# EAGLE design raspdoor (EAGLE 6.5.0)
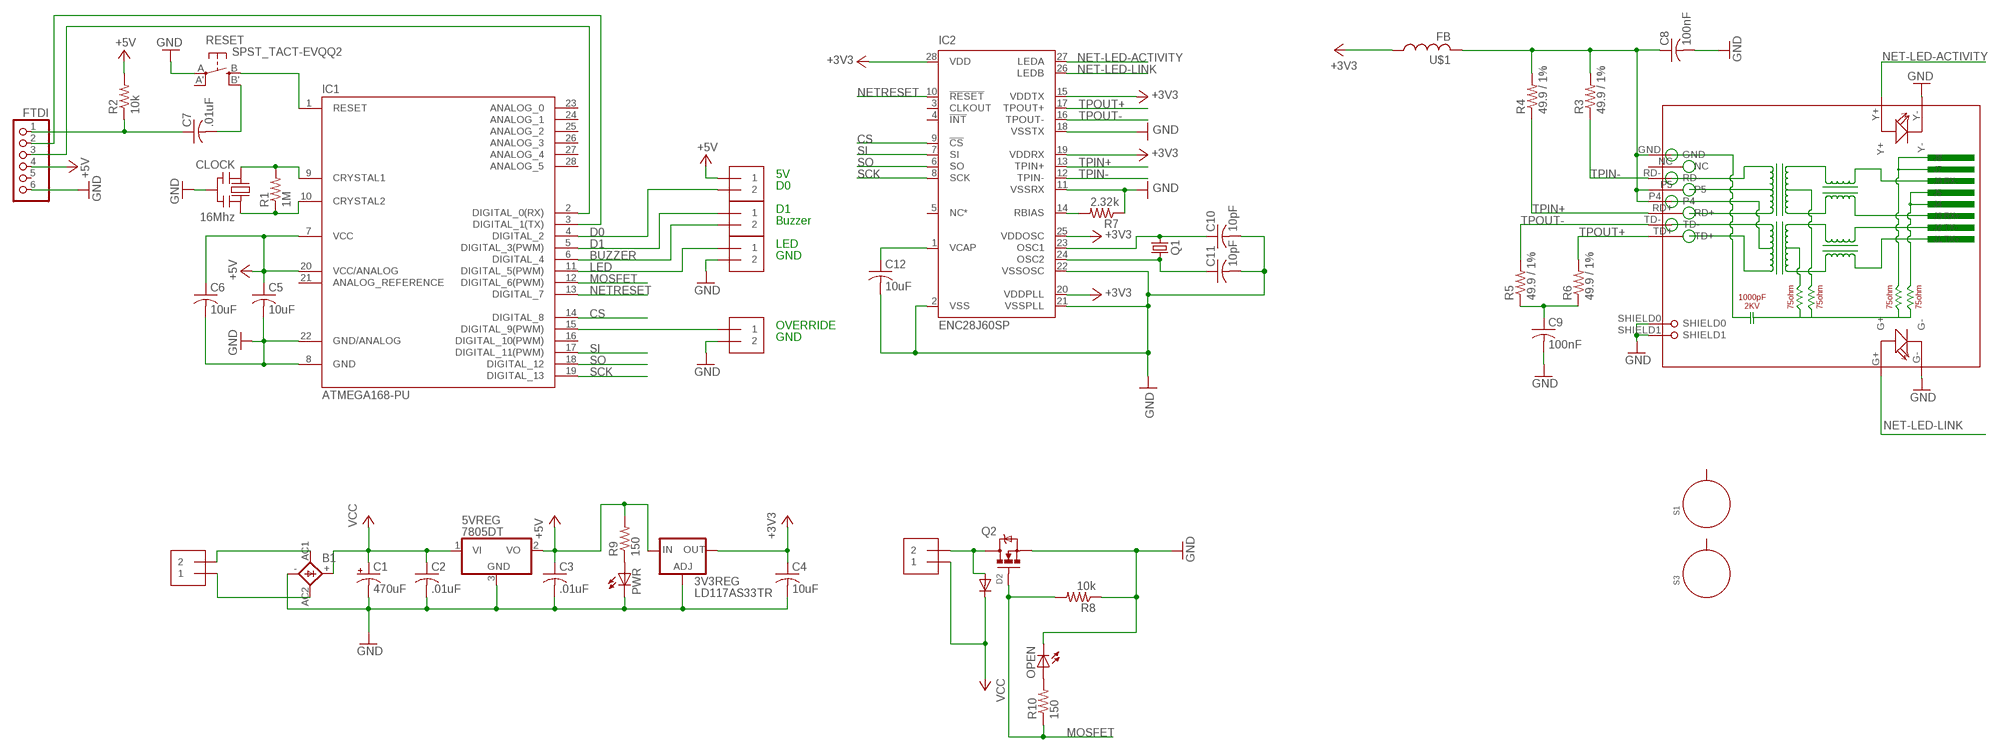
[diagram p0: schematic, sheet 1]

## Parts
3V3REG  LD117AS33TR  [SOT223]
5VREG  7805DT  [TO252]
B1  2KBB  [2KBB]
C1  470uF  CPOL-US153CLV-0810  [153CLV-0810]
C2  .01uF  C-USC0805  [C0805]
C3  .01uF  C-USC0805  [C0805]
C4  10uF  C-USC0805  [C0805]
C5  10uF  C-USC0805  [C0805]
C6  10uF  C-USC0805  [C0805]
C7  .01uF  C-USC0805  [C0805]
C8  100nF  C-USC0805  [C0805]
C9  100nF  C-USC0805  [C0805]
C10  10pF  C-USC0805  [C0805]
C11  10pF  C-USC0805  [C0805]
C12  10uF  C-USC0805  [C0805]
CLOCK  16Mhz  CERMOSCILL-THM  [CERM_OSC]
D2  DIODESMA  [SMADIODE]
FTDI  PINHD-1X6  [1X06]
IC1  ATMEGA168-PU  [DIL28-3]
IC2  ENC28J60SP  [DIL28-3]
J1  1X2-3.5MM  [1X2-3.5MM]
J2  1X2-3.5MM  [1X2-3.5MM]
J3  1X2-3.5MM  [1X2-3.5MM]
J4  1X2-3.5MM  [1X2-3.5MM]
J5  1X2-3.5MM  [1X2-3.5MM]
J6  1X2-3.5MM  [1X2-3.5MM]
OPEN  LEDCHIPLED_0805  [CHIPLED_0805]
PWR  LEDCHIPLED_0805  [CHIPLED_0805]
Q1  CRYSTALHC49S  [HC49/S]
Q2  MOSFET-NCHANNELFQP30N06L  [TO220V]
R1  1M  R-US_R0805  [R0805]
R2  10k  R-US_R0805  [R0805]
R3  49.9 / 1%  R-US_R0805  [R0805]
R4  49.9 / 1%  R-US_R0805  [R0805]
R5  49.9 / 1%  R-US_R0805  [R0805]
R6  49.9 / 1%  R-US_R0805  [R0805]
R7  2.32k  R-US_R0805  [R0805]
R8  10k  R-US_R0805  [R0805]
R9  150  R-US_R0805  [R0805]
R10  150  R-US_R0805  [R0805]
RESET  SPST_TACT-EVQQ2  [EVQ-Q2]
RJ1  HR911105A  [HR911105A]
S1  STANDOFF_ELECTRICAL  [STANDOFF-ELECTRICAL]
S3  STANDOFF_ELECTRICAL  [STANDOFF-ELECTRICAL]
U$1  FB  [FB]

## Nets
+3V3: 3V3REG.4(OUT) C4.1 IC2.15(VDDTX) IC2.19(VDDRX) IC2.20(VDDPLL) IC2.25(VDDOSC) IC2.28(VDD) U$1.P$1
+5V: 3V3REG.3(IN) 5VREG.2(VO) C3.1 C5.1 C6.1 FTDI.4 IC1.7(VCC) IC1.20(VCC/ANALOG) J3.1 R2.2 R9.2
AC1 [AC1]: B1.AC1 J1.2
AC2 [AC1]: B1.AC2 J1.1
BUZZER: IC1.6(DIGITAL_4) J4.2
CS: IC1.14(DIGITAL_8) IC2.9(!CS)
D0: IC1.4(DIGITAL_2) J3.2
D1: IC1.5(DIGITAL_3(PWM)) J4.1
GND: 3V3REG.1(ADJ) 5VREG.3(GND) B1.- C1.- C2.2 C3.2 C4.2 C5.2 C6.2 C8.2 C9.2 C10.2 C11.2 C12.2 CLOCK.P$2(GND) FTDI.6 IC1.8(GND) IC1.22(GND/ANALOG) IC2.2(VSS) IC2.11(VSSRX) IC2.18(VSSTX) IC2.21(VSSPLL) IC2.22(VSSOSC) J5.2 J6.2 OPEN.C PWR.C Q2.3(S) R7.1 R8.1 RESET.A(P) RJ1.G- RJ1.SHIELD0 RJ1.SHIELD1 RJ1.Y-
LED: IC1.11(DIGITAL_5(PWM)) J5.1
MOSFET: IC1.12(DIGITAL_6(PWM)) Q2.1(G) R8.2 R10.1
N$1: IC1.1(RESET) RESET.B(S)
N$2: C7.2 RESET.B'(S1)
N$3: C7.1 FTDI.1 R2.1
N$4: FTDI.2 IC1.3(DIGITAL_1(TX))
N$5: CLOCK.P$1(IN) IC1.9(CRYSTAL1) R1.2
N$6: CLOCK.P$3(OUT) IC1.10(CRYSTAL2) R1.1
N$7: FTDI.3 IC1.2(DIGITAL_0(RX))
N$8: C8.1 R3.2 R4.2 RJ1.GND RJ1.P4 RJ1.P5 U$1.P$2
N$9: IC2.14(RBIAS) R7.2
N$10: C10.1 IC2.23(OSC1) Q1.1
N$11: C11.1 IC2.24(OSC2) Q1.2
N$12: C12.1 IC2.1(VCAP)
N$13: C9.1 R5.1 R6.1
N$14 [VCC]: D2.A J2.2 Q2.2(D)
N$15: PWR.A R9.1
N$16: OPEN.A R10.2
N$17: IC1.15(DIGITAL_9(PWM)) J6.1
NET-LED-ACTIVITY: IC2.27(LEDA) RJ1.Y+
NET-LED-LINK: IC2.26(LEDB) RJ1.G+
NETRESET: IC1.13(DIGITAL_7) IC2.10(!RESET)
SCK: IC1.19(DIGITAL_13) IC2.8(SCK)
SI: IC1.17(DIGITAL_11(PWM)) IC2.7(SI)
SO: IC1.18(DIGITAL_12) IC2.6(SO)
TPIN+: IC2.13(TPIN+) R4.1 RJ1.RD+
TPIN-: IC2.12(TPIN-) R3.1 RJ1.RD-
TPOUT+: IC2.17(TPOUT+) R6.2 RJ1.TD+
TPOUT-: IC2.16(TPOUT-) R5.2 RJ1.TD-
VCC [VCC]: 5VREG.1(VI) B1.+ C1.+ C2.1 D2.C J2.1
Unconnected: FTDI.5 IC1.16(DIGITAL_10(PWM)) IC1.21(ANALOG_REFERENCE) IC1.23(ANALOG_0) IC1.24(ANALOG_1) IC1.25(ANALOG_2) IC1.26(ANALOG_3) IC1.27(ANALOG_4) IC1.28(ANALOG_5) IC2.3(CLKOUT) IC2.4(!INT) IC2.5(NC*) RESET.A'(P1) RJ1.NC S1.P1 S3.P1

## Notes on the sheet
- 5V
- D0
- D1
- Buzzer
- LED
- GND
- OVERRIDE
- GND

## Library data of the parts
3V3REG = v-reg:LD117A?*: Low drop fixed and adjustable positive voltage regulators 1 A Source: http://www.st.com/stonline/products/literature/ds/7194/ld1117axx.pdf
5VREG = adafruit:78*: Positive VOLTAGE REGULATOR Added bigger pads to the TO-92 package
B1 = rectifier:2KBB: RECTIFIER grid 3 x 5 mm
C1 = adafruit:CPOL-US: POLARIZED CAPACITOR, American symbol
C2-C12 = adafruit:C-US: CAPACITOR, American symbol
CLOCK = adafruit:CERMOSCILL: Ceramic oscillator with built in capacitors such as ZTT-12MHz http://www.ladyada.net/library/eagle
D2 = adafruit:DIODE: Diode SMADIODE - SMA Surface Mount Package 20V 1A Schottky Diode Digikey: 641-1014-6-ND DO-1N4148 - Through Hole Small Current Diode SOD-123 20V 1 A (.5mV Vf) Schottky Diode - Digikey: MBRX120TPMSCT-ND SOD-323 10V 570mA (.38mV Vf, 3ns) Schottky Diode - Digikey: ZLLS410CT-ND SOD-523 30V 30mA Schottky Diode (RB751S-40TE61) - Digikey: RB751S-40TE61CT-ND SOT23-R/W - SOT23 Package (R = Solder Paste/Reflow Ovens, W = Hand-Soldering) BAT54Film 40V 300mA - Digikey: 497-7162-1-ND
FTDI = adafruit:PINHD-1X6: PIN HEADER
IC1 = Arduino-AVR:ATMEGA168-PU
IC2 = microchip:ENC28J60: Stand-Alone Ethernet Controller with SPI Interface Source: http://ww1.microchip.com/downloads/en/DeviceDoc/39662c.pdf; MF: MICROCHIP; MPN: ENC28J60/SP; OC_FARNELL: 1084619; OC_NEWARK: 96K3661
J1-J6 = adafruit:1X2: 3.5mm Terminal block http://www.ladyada.net/library/pcb/eaglelibrary.html
OPEN PWR = adafruit:LED: LED OSRAM: - CHIPLED LG R971, LG N971, LY N971, LG Q971, LY Q971, LO R971, LY R971 LH N974, LH R974 LS Q976, LO Q976, LY Q976 LO Q996 - Hyper CHIPLED LW Q18S LB Q993, LB Q99A, LB R99A - SideLED LS A670, LO A670, LY A670, LG A670, LP A670 LB A673, LV A673, LT A673, LW A673 LH A674 LY A675 LS A676, LA A676, LO A676, LY A676, LW A676 LS A679, LY A679, LG A679 - Hyper Micro SIDELED® LS Y876, LA Y876, LO Y876, LY Y876 LT Y87S - SmartLED LW L88C, LW L88S LB L89C, LB L89S, LG L890 LS L89K, LO L89K, LY L89K LS L896, LA L896, LO L896, LY L896 - TOPLED LS T670, LO T670, LY T670, LG T670, LP T670 LSG T670, LSP T670, LSY T670, LOP T670, LYG T670 LG T671, LOG T671, LSG T671 LB T673, LV T673, LT T673, LW T673 LH T674 LS T676, LA T676, LO T676, LY T676, LB T676, LH T676, LSB T676, LW T676 LB T67C, LV T67C, LT T67C, LS T67K, LO T67K, LY T67K, LW E67C LS E67B, LA E67B, LO E67B, LY E67B, LB E67C, LV E67C, LT E67C LW T67C LS T679, LY T679, LG T679 LS T770, LO T770, LY T770, LG T770, LP T770 LB T773, LV T773, LT T773, LW T773 LH T774 LS E675, LA E675, LY E675, LS T675 LS T776, LA T776, LO T776, LY T776, LB T776 LHGB T686 LT T68C, LB T68C - Hyper Mini TOPLED® LB M676 - Mini TOPLED Santana® LG M470 LS M47K, LO M47K, LY M47K Source: http://www.osram.convergy.de/
Q1 = adafruit:CRYSTAL: CRYSTAL; OC_FARNELL: 1667008; OC_NEWARK: unknown
Q2 = SparkFun-DiscreteSemi:MOSFET-NCHANNEL: Common NMOSFET Parts MFG P/N Store ID Prod ID FDD8780 TRANS-09984 SI7820DN TRANS-11055 FDS6630A IC-08089 2N7002PW TRANS-11151 FQP30N06L COM-10213 TRANS-10060 BSS123LT1G TRANS-08345 BSS138 TRANS-00830 BS170 2N7000; PROD_ID: TRANS-10060
R1-R10 = adafruit:R-US_: RESISTOR, American symbol
RESET = adafruit:SPST_TACT: SMT 6mm switch, EVQQ2 series http://www.ladyada.net/library/eagle
RJ1 = HanRun:HR911105A
S1 S3 = SparkFun-Electromechanical:STANDOFF_ELECTRICAL: A standoff intended to be an electrically connected point. Pad size and stop size allow for a #4 Phillips pan screw head to make a solid connection to the board.
U$1 = adafruit:FB: Ferrite bead Digikey #P9821BK-ND

## Net classes
0 default: width 0.254 mm, drill 0.33 mm, clearance 0.203 mm
1 AC1: width 0.813 mm, clearance 0.254 mm
2 VCC: width 0.813 mm, clearance 0.254 mm

## Board
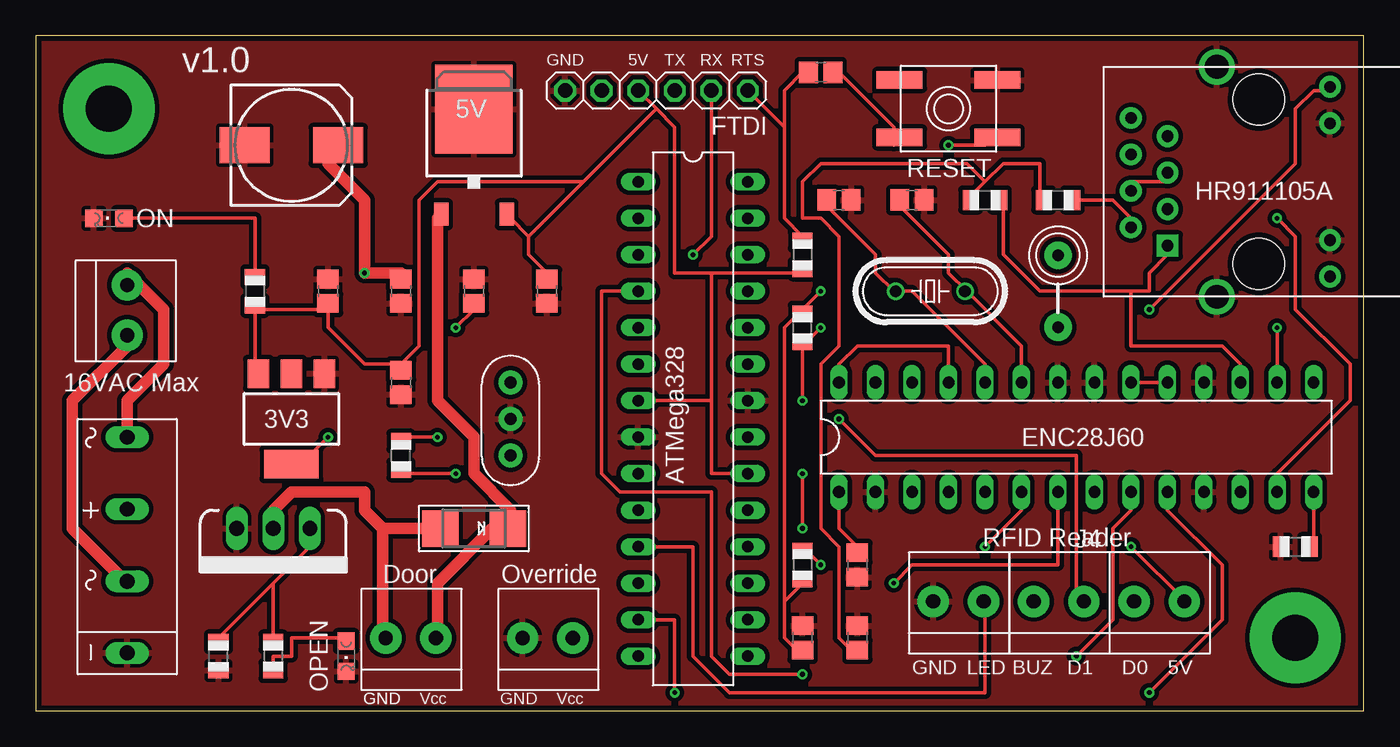
[diagram p1: board, top side]
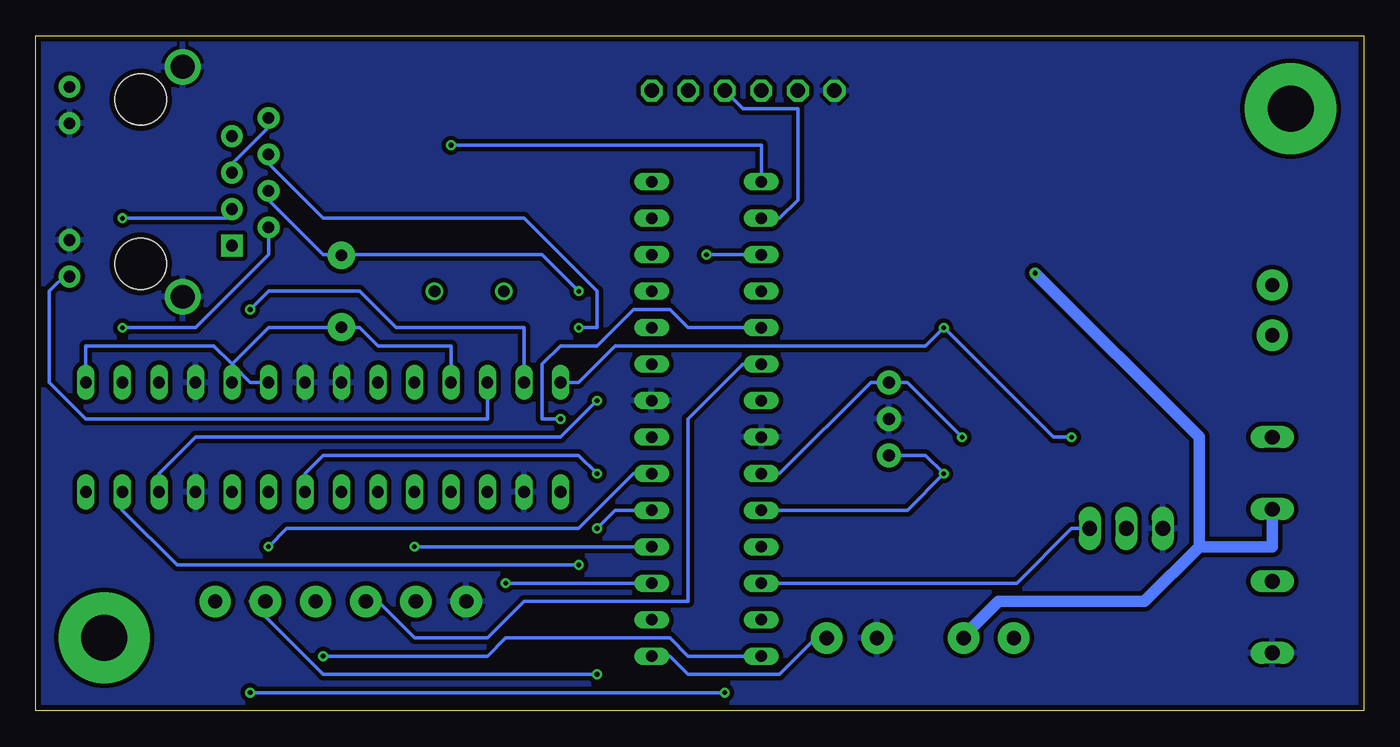
[diagram p2: board, bottom side, seen from below]

Size 92.38 x 46.98 mm. Coordinates in mm from the lower left corner, seen from the top.
Outline: 0,0 92.38,0 92.38,46.98 0,46.98 0,0
Copper layers (1*16): Top 0.0356mm / dielectric 1.5011mm / Bottom 0.0356mm
Design rules "OSHPark": minimum track width 6mil, minimum drill 13mil, track to track 6mil, track to pad 6mil, pad to pad 6mil, via to via 6mil, smd to smd 6mil, copper to edge 15mil, drill to drill 6mil, minimum pad ring 7mil, minimum via ring 7mil, stop-mask expansion 3mil, vias tented up to drill 0mil, thermal gap 10mil

### Footprints (pad centres in the part's own frame; a part is rotated, then mirrored left to right if it is on the bottom)
SOT223 = smd 1.5 x 2: 1 -2.3,-3.15; 2 0,-3.15; 3 2.3,-3.15 | smd 3.8 x 2: 4 0,3.15
TO252 = smd 1 x 1.6: 1 -2.28,-4.8; 2 2.28,-4.8 | smd 5.4 x 6.2: 3 0,2.5
2KBB = drill 1.016 long: + -2.616,0; - 7.391,0; AC1 -7.62,0; AC2 2.413,0
153CLV-0810 = smd 3.5 x 2.5: + 3.25,0; - -3.25,0
C0805 = smd 1.3 x 1.5: 1 -0.85,0; 2 0.85,0
CERM_OSC = drill 0.813 pad 1.676: P$1 -2.54,0; P$2 0,0; P$3 2.54,0
SMADIODE = smd 2.54 x 2.54: A 2.349,0; C -2.349,0
1X06 = drill 1.016 octagon: 1 -6.35,0; 2 -3.81,0; 3 -1.27,0; 4 1.27,0; 5 3.81,0; 6 6.35,0
DIL28-3 = drill 0.813 long: 1 -16.51,-3.81; 2 -13.97,-3.81; 3 -11.43,-3.81; 4 -8.89,-3.81; 5 -6.35,-3.81; 6 -3.81,-3.81; 7 -1.27,-3.81; 8 1.27,-3.81; 9 3.81,-3.81; 10 6.35,-3.81; 11 8.89,-3.81; 12 11.43,-3.81; 13 13.97,-3.81; 14 16.51,-3.81; 15 16.51,3.81; 16 13.97,3.81; 17 11.43,3.81; 18 8.89,3.81; 19 6.35,3.81; 20 3.81,3.81; 21 1.27,3.81; 22 -1.27,3.81; 23 -3.81,3.81; 24 -6.35,3.81; 25 -8.89,3.81; 26 -11.43,3.81; 27 -13.97,3.81; 28 -16.51,3.81
1X2-3.5MM = drill 1 pad 2.184: 1 1.8,0; 2 -1.7,0
CHIPLED_0805 = smd 1.2 x 1.2: A 0,-1.05; C 0,1.05
HC49/S = drill 0.813: 1 -2.413,0; 2 2.413,0
TO220V = drill 1.016 long: 1 -2.54,0; 2 0,0; 3 2.54,0
R0805 = smd 1.1 x 1.4: 1 -1,0; 2 1,0
EVQ-Q2 = smd 3.2 x 1.2: A -3.4,-2; A' 3.4,-2; B -3.4,2; B' 3.4,2
HR911105A = drill 0.813 pad 1.524: G+ 4.953,-6.604; G- 4.953,-4.064; GND -8.89,4.445; NC -6.35,3.175; P4 -8.89,-0.635; P5 -6.35,0.635; RD+ -6.35,-1.905; RD- -8.89,1.905; TD- -8.89,-3.175; Y+ 4.953,6.604; Y- 4.953,4.064 | drill 1.651 pad 2.159: SHIELD0 -2.921,8.001; SHIELD1 -2.921,-8.001 | drill 0.813 pad 1.524 square: TD+ -6.35,-4.445 | hole 3.556: 0,-5.715; 0,5.715
STANDOFF-ELECTRICAL = drill 3.2 pad 6.35: P1 0,0
FB = drill 0.8 pad 1.93: P$1 -2.5,0; P$2 2.5,0

### Placement (x,y rotation side)
3V3REG  17.78,20.32 180 top
5VREG  30.48,39.37 0 top
B1  6.35,11.43 270 top
C1  17.78,39.37 0 top
C2  25.4,29.21 270 top
C3  20.32,29.21 90 top
C4  30.48,29.21 90 top
C5  35.56,29.21 270 top
C6  25.4,22.86 270 top
C7  54.61,44.45 0 top
C8  53.34,5.08 90 top
C9  57.15,5.08 90 top
C10  60.96,35.56 0 top
C11  55.88,35.56 0 top
C12  57.15,10.16 270 top
CLOCK  33.02,20.32 270 top
D2  30.48,12.7 180 top
FTDI  43.18,43.18 180 top
IC1  45.72,20.32 270 top
IC2  72.39,19.05 0 top
J1  6.35,27.94 270 top
J2  26.04,5.08 0 top
J3  78.11,7.62 0 top
J4  71.12,7.62 0 top
J5  64.14,7.62 0 top
J6  35.56,5.08 0 top
OPEN  21.59,3.81 180 top
PWR  5.08,34.29 90 top
Q1  62.23,29.21 180 top
Q2  16.51,12.7 180 top
R1  25.4,17.78 90 top
R2  53.34,31.75 270 top
R3  53.34,26.67 90 top
R4  53.34,10.16 270 top
R5  71.12,35.56 0 top
R6  66.04,35.56 0 top
R7  87.63,11.43 0 top
R8  12.7,3.81 90 top
R9  15.24,29.21 270 top
R10  16.51,3.81 270 top
RESET  63.5,41.91 180 top
RJ1  85.09,36.83 0 top
S1  5.08,41.91 0 top
S3  87.63,5.08 0 top
U$1  71.12,29.21 90 top

### Tracks (layer width: path | path; a pad name or v marks a point on that pad's centre or on a via)
+3V3  (via drill 0.33)
  Top 0.254: v29.21,26.67 30.48,27.94 C4.1 | v20.32,19.05 17.78,16.51 3V3REG.4 | IC2.28 55.88,24.13 57.15,25.4 63.5,25.4 IC2.25 | IC2.19 IC2.20
  Bottom 0.254: v20.32,19.05 21.59,19.05 v29.21,26.67 30.48,25.4 52.07,25.4 54.61,22.86 IC2.28 | IC2.15 88.9,25.4 80.01,25.4 78.74,24.13 | 78.74,24.13 77.47,22.86 IC2.20 | 71.12,26.67 76.2,26.67 78.74,24.13 | IC2.25 63.5,25.4 68.58,25.4 69.85,26.67 71.12,26.67 | 71.12,26.67 U$1.P$1
+5V  (via drill 0.33)
  Top 0.254: 15.24,27.94 15.24,24.13 3V3REG.3 | 15.24,27.94 20.32,27.94 | 15.24,27.94 R9.2 | 25.4,24.13 22.86,24.13 20.32,26.67 20.32,27.94 | 20.32,27.94 C3.1 | 34.29,33.02 34.29,31.75 35.56,30.48 C5.1 | 34.29,33.02 33.02,34.29 5VREG.2 | 46.99,30.48 44.45,30.48 44.45,40.64 43.18,41.91 | 46.99,30.48 53.34,30.48 R2.2 | FTDI.4 43.18,41.91 | IC1.20 46.99,16.51 46.99,21.59 | 46.99,30.48 46.99,21.59 | 46.99,21.59 IC1.7 | 43.18,41.91 38.1,36.83 | 38.1,36.83 34.29,33.02 | v76.2,11.43 80.01,7.62 J3.1 | 25.4,24.13 26.67,25.4 26.67,35.56 27.94,36.83 38.1,36.83 | 25.4,24.13 C6.1
  Bottom 0.254: v76.2,11.43 74.93,12.7 54.61,12.7 50.8,16.51 IC1.20
AC1
  Top 0.813: B1.AC1 6.35,21.59 8.89,24.13 8.89,27.94 6.35,30.48 J1.2
AC2
  Top 0.813: B1.AC2 6.35,8.89 2.54,12.7 2.54,21.59 6.35,25.4 J1.1
BUZZER
  Bottom 0.254: IC1.6 43.18,24.13 46.99,20.32 46.99,7.62 58.42,7.62 60.96,5.08 66.04,5.08 68.58,7.62 J4.2
CS  (via drill 0.33)
  Top 0.254: v72.39,3.81 74.93,6.35 74.93,12.7 76.2,13.97 IC2.9
  Bottom 0.254: IC1.14 46.99,3.81 48.26,5.08 59.69,5.08 60.96,3.81 v72.39,3.81
D0  (via drill 0.33)
  Top 0.254: IC1.4 39.37,29.21 39.37,16.51 40.64,15.24 46.99,15.24 46.99,3.81 48.26,2.54 v53.34,2.54
  Bottom 0.254: v53.34,2.54 72.39,2.54 77.47,7.62 J3.2
D1  (via drill 0.33)
  Top 0.254: v55.88,20.32 58.42,17.78 72.39,17.78 72.39,7.62 J4.1
  Bottom 0.254: IC1.5 46.99,26.67 48.26,27.94 50.8,27.94 53.34,25.4 55.88,25.4 57.15,24.13 57.15,20.32 v55.88,20.32
GND
  pour Bottom (isolate 0.305): 0,46.99 0,0 92.71,0 92.71,46.99
  pour Top (isolate 0.305): 0,46.99 0,0 92.71,0 92.71,46.99
LED
  Top 0.254: IC1.11 45.72,11.43 45.72,3.81 48.26,1.27 66.04,1.27 66.04,7.62 J5.1
MOSFET
  Top 0.254: 16.51,8.89 19.05,11.43 Q2.1 | 16.51,8.89 12.7,5.08 R8.2 | 16.51,8.89 R10.1
  Bottom 0.254: IC1.12 24.13,8.89 20.32,12.7 Q2.1
N$1  (via drill 0.33)
  Top 0.254: v63.5,39.37 66.04,39.37 RESET.B
  Bottom 0.254: IC1.1 41.91,39.37 v63.5,39.37
N$2
  Top 0.254: C7.2 55.88,44.45 59.69,40.64 59.69,39.37 RESET.B'
N$3
  Top 0.254: 52.07,40.64 52.07,34.29 53.34,33.02 R2.1 | FTDI.1 52.07,40.64 | 52.07,40.64 52.07,43.18 53.34,44.45 C7.1
N$4  (via drill 0.33)
  Top 0.254: v45.72,31.75 46.99,33.02 FTDI.2
  Bottom 0.254: v45.72,31.75 IC1.3
N$5  (via drill 0.33)
  Top 0.254: v27.94,19.05 25.4,19.05 R1.2
  Bottom 0.254: v27.94,19.05 31.75,22.86 CLOCK.P$1 34.29,22.86 40.64,16.51 IC1.9
N$6  (via drill 0.33)
  Top 0.254: v29.21,16.51 25.4,16.51 R1.1
  Bottom 0.254: CLOCK.P$3 30.48,17.78 v29.21,16.51 31.75,13.97 IC1.10
N$7
  Bottom 0.254: IC1.2 40.64,34.29 39.37,35.56 39.37,41.91 43.18,41.91 FTDI.3
N$8  (via drill 0.33)
  Top 0.254: RJ1.P5 78.74,36.83 76.2,36.83 RJ1.P4 | 52.07,7.62 53.34,8.89 R4.2 | 52.07,7.62 52.07,5.08 53.34,3.81 C8.1 | 53.34,27.94 52.07,26.67 52.07,7.62 | 53.34,27.94 v54.61,29.21 | 53.34,27.94 R3.2
  Bottom 0.254: 71.12,31.75 72.39,31.75 76.2,35.56 RJ1.P4 | RJ1.GND 76.2,40.64 78.74,38.1 RJ1.P5 | 71.12,31.75 57.15,31.75 v54.61,29.21 | 71.12,31.75 U$1.P$2
N$9
  Top 0.254: IC2.14 88.9,11.43 R7.2
N$10
  Top 0.254: 64.77,29.21 63.5,30.48 63.5,31.75 59.69,35.56 C10.1 | IC2.23 68.58,25.4 64.77,29.21 | 64.77,29.21 Q1.1
N$11
  Top 0.254: C11.1 54.61,35.56 58.42,31.75 58.42,30.48 59.69,29.21 Q1.2 60.96,29.21 66.04,24.13 IC2.24
N$12
  Top 0.254: IC2.1 55.88,12.7 57.15,11.43 C12.1
N$13
  Top 0.254: 66.04,36.83 67.31,38.1 69.85,38.1 69.85,35.56 R5.1 | 66.04,36.83 64.77,35.56 R6.1 | 66.04,36.83 64.77,38.1 54.61,38.1 53.34,36.83 53.34,34.29 54.61,34.29 55.88,33.02 55.88,25.4 54.61,24.13 54.61,12.7 55.88,11.43 55.88,5.08 57.15,3.81 C9.1
N$14
  Top 0.813: 24.13,12.7 D2.A | 24.13,12.7 24.13,5.08 J2.2 | Q2.2 16.51,13.97 17.78,15.24 22.86,15.24 22.86,13.97 24.13,12.7
N$15
  Top 0.254: PWR.A 15.24,34.29 R9.1
N$16
  Top 0.254: OPEN.A 21.59,5.08 17.78,5.08 17.78,3.81 16.51,3.81 R10.2 16.51,2.54
N$17
  Bottom 0.254: IC1.15 48.26,3.81 46.99,2.54 40.64,2.54 38.1,5.08 J6.1
NET-LED-ACTIVITY  (via drill 0.33)
  Top 0.254: v77.47,27.94 87.63,38.1 87.63,41.91 88.9,43.18 90.17,43.18 RJ1.Y+
  Bottom 0.254: IC2.27 58.42,26.67 67.31,26.67 69.85,29.21 76.2,29.21 v77.47,27.94
NET-LED-LINK
  Bottom 0.254: IC2.26 60.96,20.32 88.9,20.32 91.44,22.86 91.44,29.21 90.17,30.48 RJ1.G+
NETRESET  (via drill 0.33)
  Top 0.254: IC1.13 44.45,6.35 v44.45,1.27 | v77.47,1.27 82.55,6.35 82.55,10.16 78.74,13.97 IC2.10
  Bottom 0.254: v77.47,1.27 v44.45,1.27
SCK  (via drill 0.33)
  Top 0.254: v53.34,16.51 v53.34,12.7
  Bottom 0.254: IC1.19 52.07,13.97 v53.34,12.7 | v53.34,16.51 54.61,17.78 72.39,17.78 73.66,16.51 IC2.8
SI  (via drill 0.33)
  Top 0.254: v59.69,8.89 60.96,10.16 71.12,10.16 IC2.7
  Bottom 0.254: v59.69,8.89 IC1.17
SO  (via drill 0.33)
  Top 0.254: v66.04,11.43 68.58,13.97 IC2.6
  Bottom 0.254: v66.04,11.43 IC1.18
TPIN+  (via drill 0.33)
  Top 0.254: v54.61,10.16 53.34,11.43 R4.1 | v86.36,34.29 87.63,33.02 87.63,27.94 91.44,24.13 91.44,21.59 86.36,16.51 IC2.13
  Bottom 0.254: v54.61,10.16 82.55,10.16 86.36,13.97 IC2.13 | v86.36,34.29 78.74,34.29 RJ1.RD+
TPIN-  (via drill 0.33)
  Top 0.254: v53.34,21.59 53.34,25.4 | 53.34,25.4 v54.61,26.67 | 53.34,25.4 R3.1
  Bottom 0.254: v53.34,21.59 55.88,19.05 81.28,19.05 83.82,16.51 IC2.12 | v54.61,26.67 53.34,26.67 53.34,29.21 58.42,34.29 72.39,34.29 76.2,38.1 RJ1.RD-
TPOUT+
  Top 0.254: 76.2,29.21 77.47,29.21 77.47,30.48 78.74,31.75 RJ1.TD+ | 76.2,29.21 69.85,29.21 67.31,31.75 67.31,35.56 R6.2 | IC2.17 83.82,24.13 82.55,25.4 76.2,25.4 76.2,29.21
TPOUT-  (via drill 0.33)
  Top 0.254: R5.2 74.93,35.56 76.2,34.29 RJ1.TD- | v86.36,26.67 IC2.16
  Bottom 0.254: v86.36,26.67 81.28,26.67 76.2,31.75 RJ1.TD-
VCC  (via drill 0.33)
  Top 0.813: 5VREG.1 27.94,34.29 27.94,21.59 30.48,19.05 30.48,16.51 33.02,13.97 33.02,12.7 D2.C 31.75,12.7 27.94,8.89 27.94,5.08 J2.1 | C2.1 25.4,30.48 v22.86,30.48 22.86,35.56 20.32,38.1 20.32,39.37 C1.+
  Bottom 0.813: B1.+ 6.35,11.43 11.43,11.43 | 11.43,11.43 15.24,7.62 25.4,7.62 27.94,5.08 J2.1 | v22.86,30.48 11.43,19.05 11.43,11.43

### Text on the board
tPlace: GND | 5V | TX | RX | RTS | v1.0 | 5V | HR911105A | ON | ATMega328 | 16VAC Max | 3V3 | ENC28J60 | RFID Reader | Door | Override | OPEN | GND | LED | BUZ | D1 | D0 | 5V | GND | GND | Vcc | GND | Vcc